# Altium schematic sheet Sheet1.SchDocEVAL.SchDoc
size A4; SheetNumber: 1; SheetTotal: 1
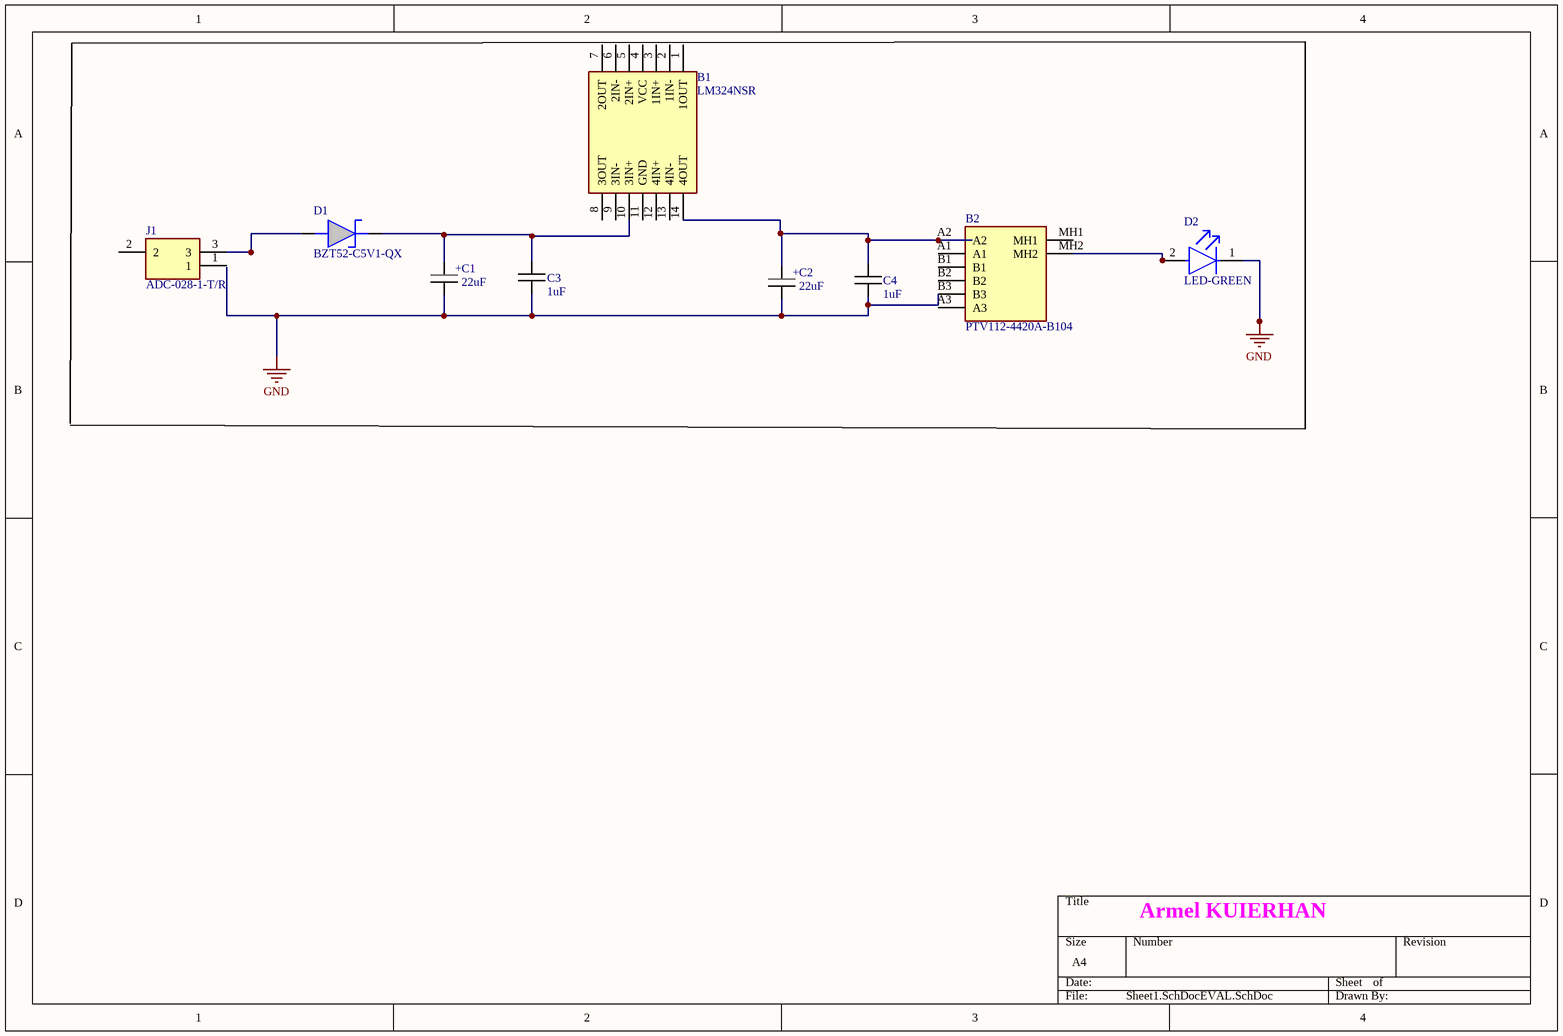
[diagram p0: Sheet1.SchDocEVAL.SchDoc]

## Parts
B1  LM324NSR  [SOIC127P780X200-14N]
B2  PTV112-4420A-B104  [PTV1124420AB104]
C1  22uF  [CAPC1005X06N]
C2  22uF  [CAPC1005X06N]
C3  1uF  [CAPC1005X06N]
C4  1uF  [CAPC1005X06N]
D1  BZT52-C5V1-QX  [SOD3616X130N]
D2  LED-GREEN  [SMD-1608-LED]
J1  ADC-028-1-T/R  [PJ1021SMTTR]

## Nets
GND: B2.B3 C1.2 C2.2 C3.1 C4.1 D2.1(C)
NetB1_10: B1.10(3IN+) C1.1 C3.2 D1.1(K)
NetB1_14: B1.14(4OUT) B2.A2 C2.1 C4.2
NetB2_MH2: B2.MH2 D2.2(A)
NetD1_2: D1.2(A) J1.3

Not connected (* = marked no-connect by the designer): B1 1(1OUT) 2(1IN-) 3(1IN+) 4(VCC) 5(2IN+) 6(2IN-) 7(2OUT) 8(3OUT) 9(3IN-) 11(GND) 12(4IN+) 13(4IN-); B2 A1 A3 B1 B2 MH1; J1 1 2

## Notes on the sheet
- Armel KUIERHAN
- (in symbol Capacitor_pol) +

## Library data of the parts
B1 = LM324NSR: Quadruple Operational Amplifier; Manufacturer_Name: Texas Instruments; Geometry.Height: 2mm; Manufacturer_Part_Number: LM324NSR; Mouser Part Number: 595-LM324NSR; Mouser Price/Stock: https://www.mouser.co.uk/ProductDetail/Texas-Instruments/LM324NSR?qs=VBduBm9rCJQcjq4eh95DkA%3D%3D; Arrow Part Number: LM324NSR; Arrow Price/Stock: https://www.arrow.com/en/products/lm324nsr/texas-instruments?utm_currency=USD&region=nac; Datasheet Link: http://www.ti.com/lit/gpn/LM324
B2 = PTV112-4420A-B104: Potentiometers PANEL CONTROL 100kOhm; Manufacturer_Name: Bourns; Geometry.Height: 20.5mm; Manufacturer_Part_Number: PTV112-4420A-B104; Mouser Part Number: 652-PTV1124420AB104; Mouser Price/Stock: https://www.mouser.co.uk/ProductDetail/Bourns/PTV112-4420A-B104?qs=nqw9FAyaR8PT4wHHFlLdhA%3D%3D; Arrow Part Number: *; Arrow Price/Stock: *; Datasheet Link: https://www.bourns.com/docs/Product-Datasheets/PTVPTT.pdf
C1 C2 = Capacitor_pol
C3 C4 = Capacitor
D1 = BZT52-C5V1-QX: BZT52-Q series - Voltage regulator diodes@en-us; Manufacturer_Name: Nexperia; Geometry.Height: 1.3mm; Manufacturer_Part_Number: BZT52-C5V1-QX; Mouser Part Number: 771-BZT52-C5V1-QX; Mouser Price/Stock: https://www.mouser.co.uk/ProductDetail/Nexperia/BZT52-C5V1-QX?qs=rQFj71Wb1eWpKfJh0U4RGA%3D%3D; Arrow Part Number: *; Arrow Price/Stock: *; Datasheet Link: https://assets.nexperia.com/documents/data-sheet/BZT52-Q_SER.pdf
D2 = LED-GREEN: LED GREEN CLEAR CHIP SMD LTST-C190GKT; Dominant Wavelength: 569nm; Reverse Voltage: 5V; Lens Color: Colorless; Viewing Angle: 130°; Voltage: 2V; Forward Current: 30mA; Power Dissipation: 100mW; Luminous Intensity: 6mcd; Number of LEDs: 1; Forward Voltage: 2.1V; Wavelength: 565nm; Test Current: 10mA; Min Operating Temperature: -55°C; Lens Style: Clear; Mount: Surface Mount; Width: 0.8mm; Packaging: Tape and Reel; Lens Transparency: Clear; Case Code (Metric): 1608; Depth: 0.8mm; Case Code (Imperial): 0603; Case/Package: 0603; Number of Pins: 2; Max Operating Temperature: 85°C; Lead Free: Lead Free; Number of Elements: 1; Length: 1.6mm; Height: 0.8mm; Package Quantity: 1; Power Rating: 100mW; Radiation Hardening: No; Illumination Color: Green; Color: Green
J1 = ADC-028-1-T/R: Connecteurs d'alimentation continue DC POWER JACK 2MM PIN TYPE 028; Manufacturer_Name: Same Sky; Geometry.Height: 6mm; Manufacturer_Part_Number: ADC-028-1-T/R; Mouser Part Number: 737-ADC-028-1-T/R; Mouser Price/Stock: https://www.mouser.fr/ProductDetail/Adam-Tech/ADC-028-1-T-R?qs=TTVbHWoAP%2FSiqsZeR9Co0Q%3D%3D